# EAGLE schematic gymk_stopwatch (EAGLE 8.1.1)
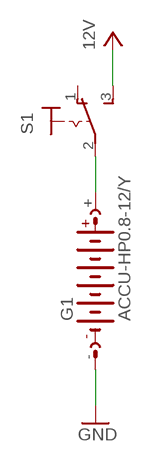
[diagram p0: schematic, sheet 1]

## Parts
G1  ACCU-HP0.8-12/Y  AB9V  [AB9V]
S1  M9040P  [M9040P]

## Nets
GND: G1.-
N$1: G1.+ S1.2(P)
VCC: S1.3(S) ; supply symbol labelled 12V
Unconnected: S1.1(O)

## Library data of the parts
G1 = battery:AB9V: 9-V BATTERY CLIP
S1 = switch:M9040P: TOGGLE SWITCH Marquardt